# Altium schematic sheet 3phaseBridgeRecitifed.SchDoc
size A; SheetNumber: 1; SheetTotal: 1
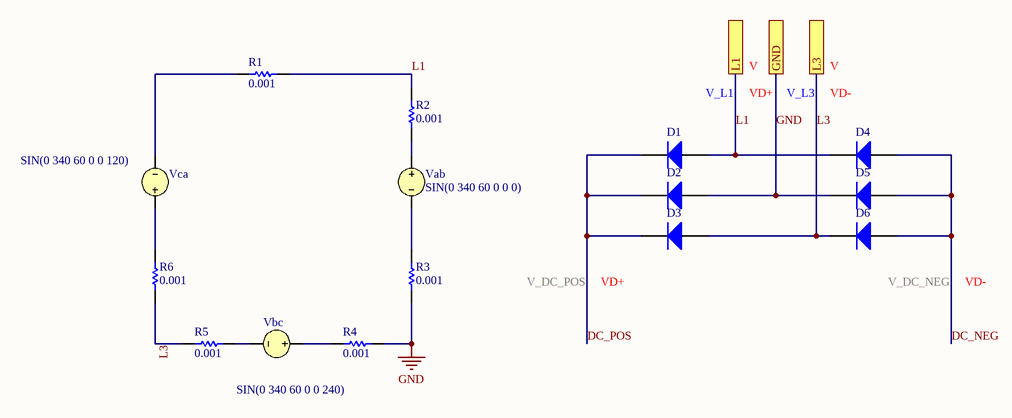
[diagram p0: 3phaseBridgeRecitifed.SchDoc]

## Parts
D1  Diode  (value not drawn)
D2  Diode  (value not drawn)
D3  Diode  (value not drawn)
D4  Diode  (value not drawn)
D5  Diode  (value not drawn)
D6  Diode  (value not drawn)
R1  value 0.001  (hidden comment: Resistor)
R2  value 0.001  (hidden comment: Resistor)
R3  value 0.001  (hidden comment: Resistor)
R4  value 0.001  (hidden comment: Resistor)
R5  value 0.001  (hidden comment: Resistor)
R6  value 0.001  (hidden comment: Resistor)
Vab  SIN(0 340 60 0 0 0)
Vbc  SIN(0 340 60 0 0 240)
Vca  SIN(0 340 60 0 0 120)

## Ports
GND, L1, L3

## Nets
GND: D2.1(A) D5.2(K) R3.1 R4.2 ; port GND
DC_NEG: D4.1(A) D5.1(A) D6.1(A)
DC_POS: D1.2(K) D2.2(K) D3.2(K)
L1: D1.1(A) D4.2(K) R1.2 R2.1 ; port L1
L3: D3.1(A) D6.2(K) R5.1 R6.1 ; port L3
NetR1_1: R1.1 Vca.2
NetR2_2: R2.2 Vab.1
NetR3_2: R3.2 Vab.2
NetR4_1: R4.1 Vbc.1
NetR5_2: R5.2 Vbc.2
NetR6_2: R6.2 Vca.1

## Library data of the parts
D1-D6 = Diode: AF: 1; BV: 0; BV_MAX: 1e99; EG: 1.11; FC: 0.5; IBV: 0.001; ISR: 1e-14; MJSW: 0.33; NTUN: 30; TNOM: 27; XTI: 3; SimulationGenericComponent: True; CJO: 0; CJP: 0; CTA: 0; CTP: 0; FCS: 0.5; FV_MAX: 1e99; IKF: 0; IKR: 0; JSW: 0; JTUN: 0; JTUNSW: 0; KEG: 1; KF: 0; LEVEL: 1; N: 1; NBV: 1; NR: 1; NS: 1; PHP: 1; RS: 0; TCV: 0; TLEV: 0; TLEVC: 0; TM1: 0; TM2: 0; TPB: 0; TPHP: 0; TRS: 0; TRS2: 0; TT: 0; TTT1: 0; TTT2: 0; VJ: 1; XTITUN: 3; IS: 1e-14
R1-R6 = Resistor: TC1: 0; SimulationGenericComponent: True; TC2: 0
Vab = VSRC: Voltage Source; Note: PCB Footprint - Not required; AC Magnitude: 340; AC Phase: 0; Frequency: 60; Published: 8-Jun-2000; LatestRevisionDate: 17-Jul-2002; LatestRevisionNote: Re-released for DXP Platform.; PackageReference: Not Applicable; Publisher: Altium Limited; DC Magnitude: 0; Offset: 0; Amplitude: 340; Delay: 0; Damping Factor: 0; Phase: 0
Vbc = VSRC: Voltage Source; Note: PCB Footprint - Not required; AC Magnitude: 340; AC Phase: 240; DC Magnitude: 0; Frequency: 60; Published: 8-Jun-2000; LatestRevisionDate: 17-Jul-2002; LatestRevisionNote: Re-released for DXP Platform.; PackageReference: Not Applicable; Publisher: Altium Limited; Offset: 0; Amplitude: 340; Delay: 0; Damping Factor: 0; Phase: 240
Vca = VSRC: Voltage Source; Note: PCB Footprint - Not required; AC Magnitude: 340; AC Phase: 120; DC Magnitude: 0; Frequency: 60; Published: 8-Jun-2000; LatestRevisionDate: 17-Jul-2002; LatestRevisionNote: Re-released for DXP Platform.; PackageReference: Not Applicable; Publisher: Altium Limited; Offset: 0; Delay: 0; Damping Factor: 0; Phase: 120; Amplitude: 340